# Altium schematic sheet GNSSModules.SchDoc
size A4; SheetNumber: 1; SheetTotal: 7
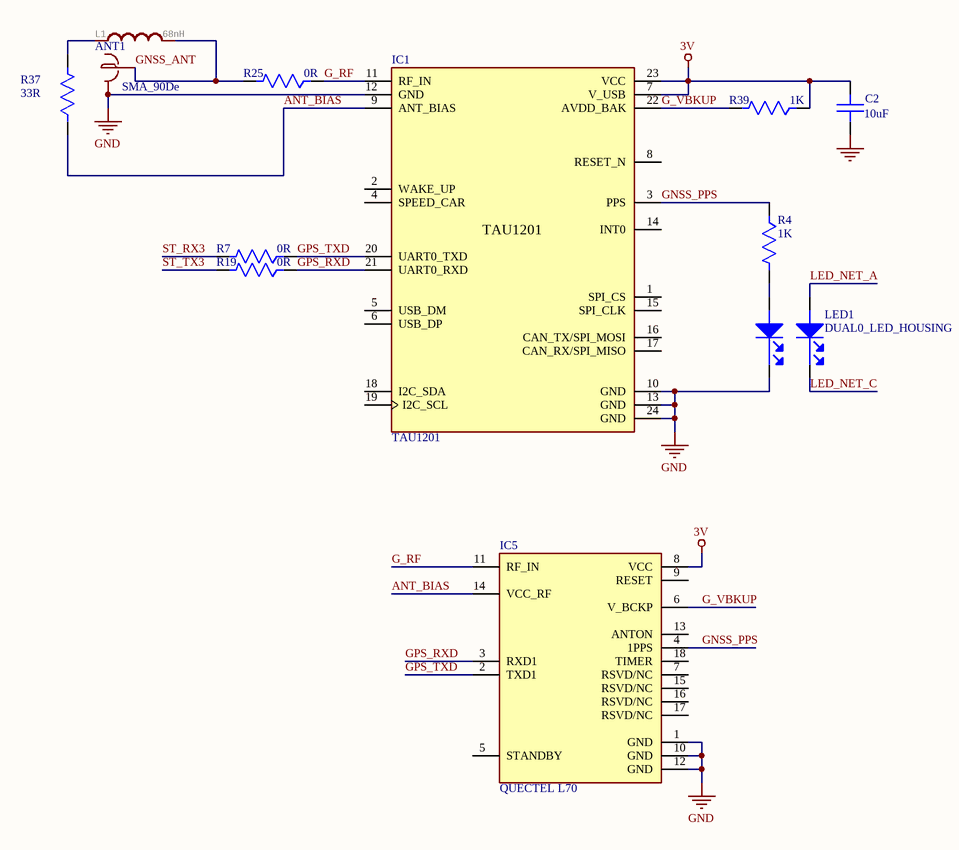
[diagram p0: GNSSModules.SchDoc]

## Parts
ANT1  SMA_90De  [SMA_90De]
C2  10uF  [C0603]
IC1  TAU1201  [GNSS_24PIN]
IC5  QUECTEL L70  [XCVR_L70]
L1  68nH  [C0603]
LED1  DUAL0_LED_HOUSING  [DUAL LED HOUSING]
R4  1K  [R0603]
R7  0R  [R0603]
R19  0R  [R0603]
R25  0R  [R0603]
R37  33R  [R0603]
R39  1K  [R0603]

## Nets
3V: C2.1 IC1.7(V_USB) IC1.23(VCC) IC5.8(VCC) R39.1
GND: ANT1.2,_3,_4,_5(GND) C2.2 IC1.10(GND) IC1.12(GND) IC1.13(GND) IC1.24(GND) IC5.1(GND) IC5.10(GND) IC5.12(GND) LED1.2
ANT_BIAS: IC1.9(ANT_BIAS) IC5.14(VCC_RF) R37.1
G_RF: IC1.11(RF_IN) IC5.11(RF_IN) R25.1
G_VBKUP: IC1.22(AVDD_BAK) IC5.6(V_BCKP) R39.2
GNSS_ANT: ANT1.1(SIG) L1.2 R25.2
GNSS_PPS: IC1.3(PPS) IC5.4(1PPS) R4.1
GPS_RXD: IC1.21(UART0_RXD) IC5.3(RXD1) R19.1
GPS_TXD: IC1.20(UART0_TXD) IC5.2(TXD1) R7.1
LED_NET_A: LED1.3
LED_NET_C: LED1.4
ST_RX3: R7.2
ST_TX3: R19.2
NetL1_1: L1.1 R37.2
NetLED1_1: LED1.1 R4.2

Not connected (* = marked no-connect by the designer): IC1 1(SPI_CS) 2(WAKE_UP) 4(SPEED_CAR) 5(USB_DM) 6(USB_DP) 8(RESET_N) 14(INT0) 15(SPI_CLK) 16(CAN_TX/SPI_MOSI) 17(CAN_RX/SPI_MISO) 18(I2C_SDA) 19(I2C_SCL); IC5 5(STANDBY) 7(RSVD/NC) 9(RESET) 13(ANTON) 15(RSVD/NC) 16(RSVD/NC) 17(RSVD/NC) 18(TIMER)

## Library data of the parts
C2 = Capacitor
IC1 = TAU1201: Multi-Band Multi-System / GNSS Positioning Module; MF: u-blox; MP: NEO-M9N-00B; Purchase-URL: https://pricing.snapeda.com/search/part/NEO-M9N-00B/?ref=eda; Value: *; SnapEDA_Link: https://www.snapeda.com/parts/NEO-M9N-00B/u-blox/view-part/?ref=snap; Package: SMD-24 u-blox; Price: None; Availability: In Stock; Check_prices: https://www.snapeda.com/parts/NEO-M9N-00B/u-blox/view-part/?ref=eda
IC5 = QUECTEL L70: GPS Module <a href="https://pricing.snapeda.com/parts/L70/Quectel/view-part?ref=eda">Check prices</a> <a href="https://pricing.snapeda.com/parts/L70/Quectel/view-part?ref=eda">Check prices</a>; Availability: Unavailable; Value: *; Package: None; Price: None; MP: L70
L1 = Inductor 0603: GateName_1: G$1; SymbolName_1: L; DeviceSetName: L0603; LibraryName: Uy_SMD; Package: 0603
R4 R7 R19 R25 R37 R39 = Resistor: SMD Resistor 0603; Manufacturer: Yageo; Manufacturer Part Number: RC0603FR-071KL; Power Rating: 100mW; Tolerance: 1%; Value: 1kR; Temperature Coefficient: 100ppm/°C; Voltage Rating: 50V; Supplier: Digi-Key; Supplier Part Number: 311-1.00KHRDKR-ND; RoHS: Yes; Category: Chip SMD Resistors; Stock: 18662657; Pricing: 1=0.1, 10=0.018, 50=0.0106, 100=0.0088, 500=0.00592, 1000=0.00505 (USD); Case/Package: 0603; Case Code (Imperial): 0603; Case Code (Metric): 1608; Contact Plating: Tin,Matte; Min Operating Temperature: -55°C; Max Operating Temperature: 155°C; Packaging: Tape and Reel; Resistor Type: Thick Film; Termination: SMD/SMT; Features: Moisture Resistant; Series: RC; Max Power Dissipation: 100mW; Number of Terminations: 2; Resistance Tolerance: 1%; Construction: Rectangular; Technology: THICK FILM; Length: 1.6mm; Height: 0.45mm; Depth: 0.8mm; Reach SVHC Compliant: No; Military Standard: Not; Lead Free: 5697LeadFree; RoHS Compliant: Yes